# Altium schematic sheet LoRaModule.SchDoc
size A; SheetNumber: 4; SheetTotal: 4
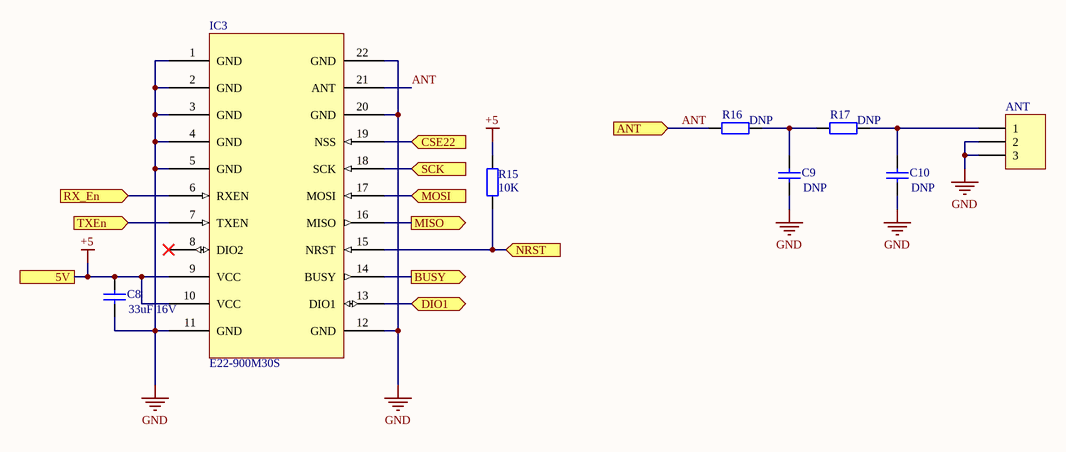
[diagram p0: LoRaModule.SchDoc]

## Parts
ANT  Header 3  [IPEX Board Conn]  (value not drawn)
C8  value 33uF 16V  [RES 1206]  (hidden comment: Cap)
C9  value DNP  [CAP0805]  (hidden comment: Cap)
C10  value DNP  [CAP0805]  (hidden comment: Cap)
IC3  E22-900M30S  [E22-900M30S]
R15  value 10K  [RES0805]  (hidden comment: Res2)
R16  value DNP  [RES0805]  (hidden comment: Res2)
R17  value DNP  [RES0805]  (hidden comment: Res2)

## Ports
5V, ANT (in), BUSY (out), CSE22 (in), DIO1 (bidir), MISO (out), MOSI (in), NRST (in), RX_En (in), SCK (in), TXEn (in)

## Nets
+5: C8.2 IC3.9(VCC) IC3.10(VCC) R15.2 ; port 5V
GND: ANT.2 ANT.3 C8.1 C9.1 C10.1 IC3.1(GND) IC3.2(GND) IC3.3(GND) IC3.4(GND) IC3.5(GND) IC3.11(GND) IC3.12(GND) IC3.20(GND) IC3.22(GND)
ANT: IC3.21(ANT) R16.1 ; port ANT
BUSY: IC3.14(BUSY) ; port BUSY
CSE22: IC3.19(NSS) ; port CSE22
DIO1: IC3.13(DIO1) ; port DIO1
MISO: IC3.16(MISO) ; port MISO
MOSI: IC3.17(MOSI) ; port MOSI
NRST: IC3.15(NRST) R15.1 ; port NRST
RX_En: IC3.6(RXEN) ; port RX_En
SCK: IC3.18(SCK) ; port SCK
TXEn: IC3.7(TXEN) ; port TXEn
NetANT_1: ANT.1 C10.2 R17.2
NetC9_2: C9.2 R16.2 R17.1

Not connected (* = marked no-connect by the designer): IC3 8(DIO2)*

## Library data of the parts
ANT = Header 3: Header, 3-Pin; LatestRevisionDate: 17-Jul-2002; LatestRevisionNote: Re-released for DXP Platform.; Publisher: Altium Limited; LCSC Part #: C88374
C8-C10 = Cap: Capacitor; Published: 8-Jun-2000; LatestRevisionDate: 17-Jul-2002; LatestRevisionNote: Re-released for DXP Platform.; PackageReference: 1206; Publisher: Altium Limited; PackageDescription: 1206
IC3 = E22-900M30S: The E22-900M30S is based on the SX1262, a new generation of / LoRaTM RF chip manufactured by Semtech, USA. It is an ultra-small / and self-developed 868MHz、915MHz SMD LoRaTM wireless module.; Datasheet: https://www.ebyte.com/en/downpdf.aspx?id=453
R15-R17 = Res2: Resistor; Published: 8-Jun-2000; LatestRevisionDate: 17-Jul-2002; LatestRevisionNote: Re-released for DXP Platform.; PackageReference: 0805; Publisher: Altium Limited; PackageDescription: 0805
  R15: LCSC Part #: C2930231